# EAGLE design School_System (EAGLE 6.1)
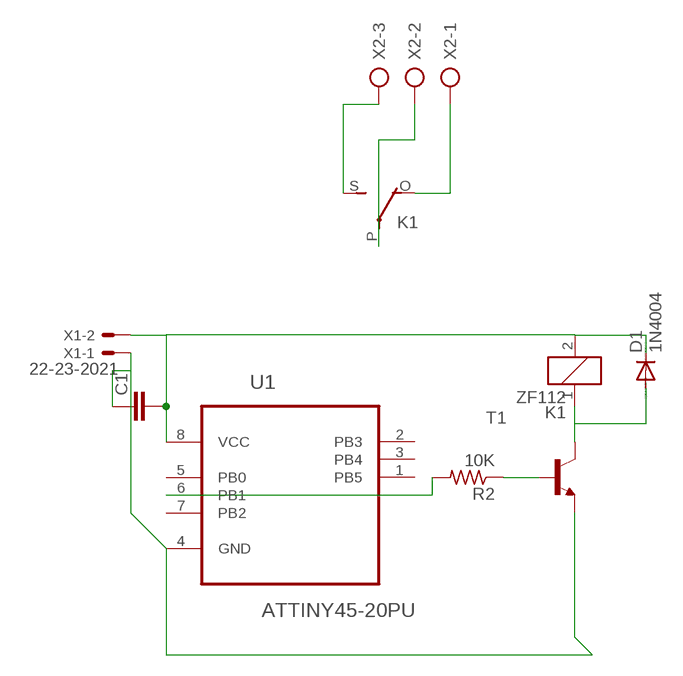
[diagram p0: schematic, sheet 1]

## Parts
C1  C2,5-3  [C2.5-3]
D1  1N4004  [DO41-10]
K1  ZF112  [ZF112]
R2  10K  R-US_0204/7  [0204/7]
T1  2N2222-NPN-TO92-EBC  [TO92-EBC]
U1  ATTINY45-20PU  [DIP254P762X533-8]
X1  22-23-2021  [22-23-2021]
X2  AK300/3  [AK300/3]

## Nets
N$1: C1.2 D1.C K1.2 U1.8(VCC) X1.2
N$2: C1.1 T1.E U1.4(GND) X1.1
N$3: R2.2 U1.6(PB1)
N$4: R2.1 T1.B
N$5: D1.A K1.1 T1.C
N$7: K1.P(2:P) X2.2
N$8: K1.S(2:S) X2.3
N$9: K1.O(2:O) X2.1
Unconnected: U1.1(PB5) U1.2(PB3) U1.3(PB4) U1.5(PB0) U1.7(PB2)

## Library data of the parts
C1 = capacitor-wima:C: CAPACITOR naming: grid - package width
D1 = diode:1N4004: DIODE general purpose rectifier, 1 A
K1 = relay:ZF112: RELAY 1 x switch; OC_FARNELL: unknown; OC_NEWARK: unknown
R2 = resistor:R-US_: RESISTOR, American symbol
T1 = transistor-neu-to92:*-NPN-: NPN Transistror
U1 = Atmel_By_element14_Batch_1-00:ATTINY45-20PU: 8-bit Microcontroller with 2/4/8KBytes In-System Programmable Flash; MPN: ATTINY45-20PU; OC_FARNELL: 1288352; OC_NEWARK: 23M5072; PACKAGE: PDIP-8; SUPPLIER: Atmel
X1 = con-molex:22-23-2021: .100" (2.54mm) Center Header - 2 Pin; MF: MOLEX; MPN: 22-23-2021; OC_FARNELL: 1462926; OC_NEWARK: 25C3832
X2 = con-ptr500:AK300/3: CONNECTOR; OC_FARNELL: unknown; OC_NEWARK: unknown

## Board
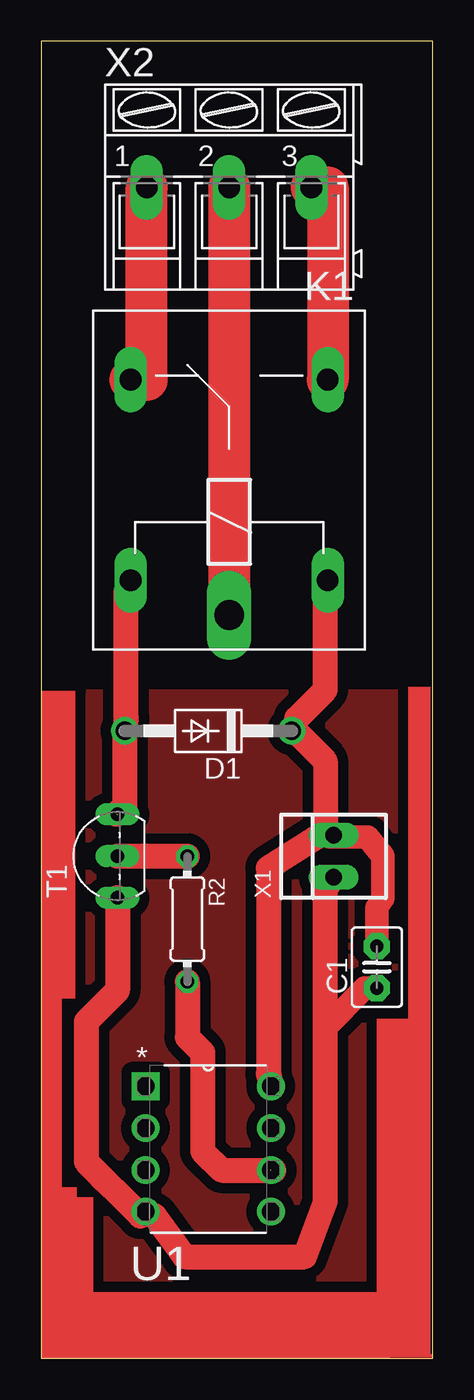
[diagram p1: board, top side]
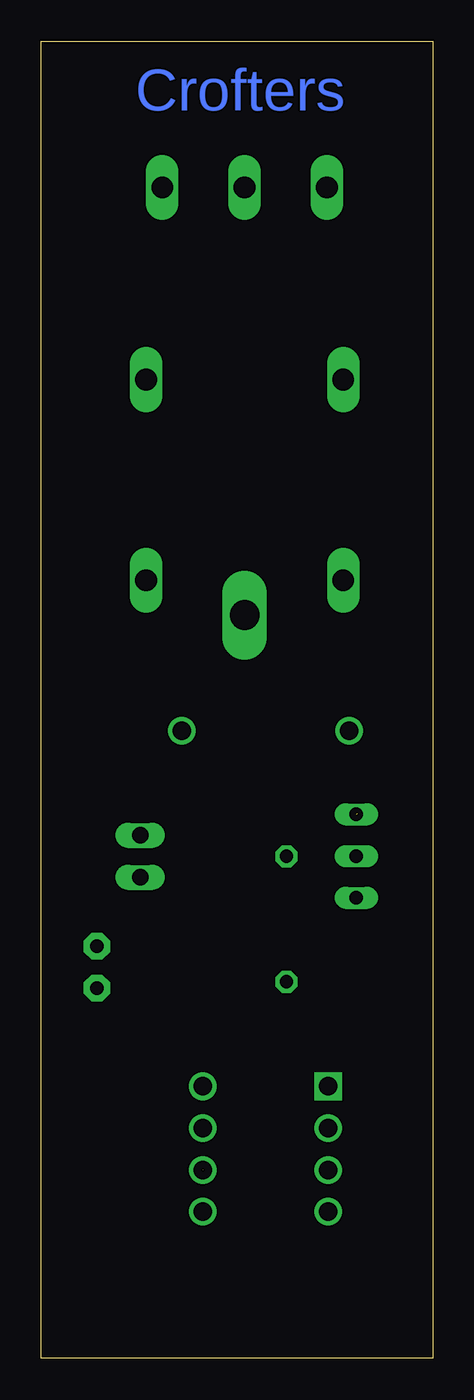
[diagram p2: board, bottom side, seen from below]

Size 23.8 x 80 mm. Coordinates in mm from the lower left corner, seen from the top.
Outline: 0,0 23.8,0 23.8,80 0,80 0,0
Copper layers (1*16): Top 0.035mm / dielectric 1.5mm / Bottom 0.035mm
Design rules: minimum track width 60mil, minimum drill 24mil, track to track 25mil, track to pad 35mil, pad to pad 8mil, via to via 8mil, smd to smd 8mil, copper to edge 40mil, drill to drill 8mil, minimum pad ring 10mil, minimum via ring 8mil, stop-mask expansion 4mil, vias tented up to drill 0mil, thermal gap 10mil

### Footprints (pad centres in the part's own frame; a part is rotated, then mirrored left to right if it is on the bottom)
C2.5-3 = drill 0.813 pad 1.6 octagon: 1 -1.27,0; 2 1.27,0
DO41-10 = drill 1.118: A 5.08,0; C -5.08,0
ZF112 = drill 1.321 long: 1 -6.096,5.994; 2 -6.096,-5.994; O 6.096,5.994; S 6.096,-5.994 | drill 1.803 long: P -8.204,0
0204/7 = drill 0.813 octagon: 1 -3.81,0; 2 3.81,0
TO92-EBC = drill 0.813 long: B 0,-1.27; C 2.54,-1.27; E -2.54,-1.27
DIP254P762X533-8 = drill 1.118 square: 1 -7.62,7.62 | drill 1.118: 2 -7.62,5.08; 3 -7.62,2.54; 4 -7.62,0; 5 0,0; 6 0,2.54; 7 0,5.08; 8 0,7.62
22-23-2021 = drill 1 long: 1 -1.27,0; 2 1.27,0
AK300/3 = drill 1.321 long: 1 -5.004,0; 2 0,0; 3 5.004,0

### Placement (x,y rotation side)
C1  20.41,23.75 90 top
D1  10.16,38.1 180 top
K1  11.43,53.34 90 top
R2  8.89,26.67 270 top
T1  3.37,30.5 90 top
U1  13.97,8.89 0 top
X1  17.78,30.48 90 top
X2  11.43,71.12 0 top

### Tracks (layer width: path | path; a pad name or v marks a point on that pad's centre or on a via)
N$1
  Top 1.422: C1.2 20.41,27.35 20.78,27.91 20.78,30.52 19.82,31.67 17.7,31.67 | 17.57,31.67 17.7,31.67 | 17.7,31.67 X1.2
  Top 1.524: 17.27,31.95 17.27,36.27 15.54,38 D1.C 15.54,38.86 17.27,40.59 17.27,46.63 K1.2 | 17.27,31.95 13.82,29.77 13.82,17.27 U1.8 | 17.27,31.95 X1.2
N$2
  Top 1.422: C1.1 19.69,22.48 17.27,20.06
  Top 1.524: 2.75,11.93 6.04,8.64 U1.4 6.91,8.64 8.72,6.16 16.03,6.16 17.27,9.5 17.27,20.06 17.27,28.5 X1.1 | 2.75,11.93 3.83,10.78 | T1.E 4.64,22.33 2.75,20.44 2.75,11.93
N$3  (1 unrouted)
  Top 1.524: R2.2 8.89,19.5 9.82,18.57 9.82,12.57 10.98,11.41 14.03,11.41 | 14.14,11.41 14.03,11.41 | 14.03,11.41 14,11.38 14.02,11.38 | 14.14,11.38 14.02,11.38 | 14.02,11.38 13.95,11.45 13.94,11.44
N$4
  Top 1.524: T1.B 8.87,30.5 R2.1
N$5  (1 unrouted)
  Top 1.524: K1.1 5.18,46.63 5.18,38.86 D1.A 5.08,33.55 4.58,33.04
N$6
  pour Top: -0.41,40.42 23.85,40.42 24.03,-0.42 -0.23,-0.42 -0.35,39.79
N$7
  Top 2.54: X2.2 K1.P 11.43,44.45
N$8
  Top 2.54: X2.3 17.42,71.12 K1.S
N$9
  Top 2.54: K1.O 6.43,59.44 X2.1
(copper drawn outside any net)
  shapes: Top area x13

### Text on the board
Top: C:/Users/Kondan/Desktop/logo.bmp
Bottom: Crofters